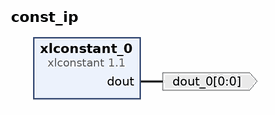
[diagram p0: block diagram of the top level]
# Vivado block design const_ip, xczu9eg-ffvb1156-2-e, Vivado 2023.2
create_bd_design const_ip

create_bd_port -dir O -from 0 -to 0 dout_0

create_bd_cell -type ip -vlnv xilinx.com:ip:xlconstant:1.1 xlconstant_0
set_property -dict {CONFIG.CONST_VAL 0} [get_bd_cells xlconstant_0]

# ---- connections ----

connect_bd_net [get_bd_pins xlconstant_0/dout] [get_bd_ports dout_0]

validate_bd_design
save_bd_design
